# Altium schematic sheet Heirarchy.SchDoc
size D; DrawnBy: Ross Harvey; Engineer: Ross Harvey; Revision: A; SheetNumber: 1; SheetTotal: 7
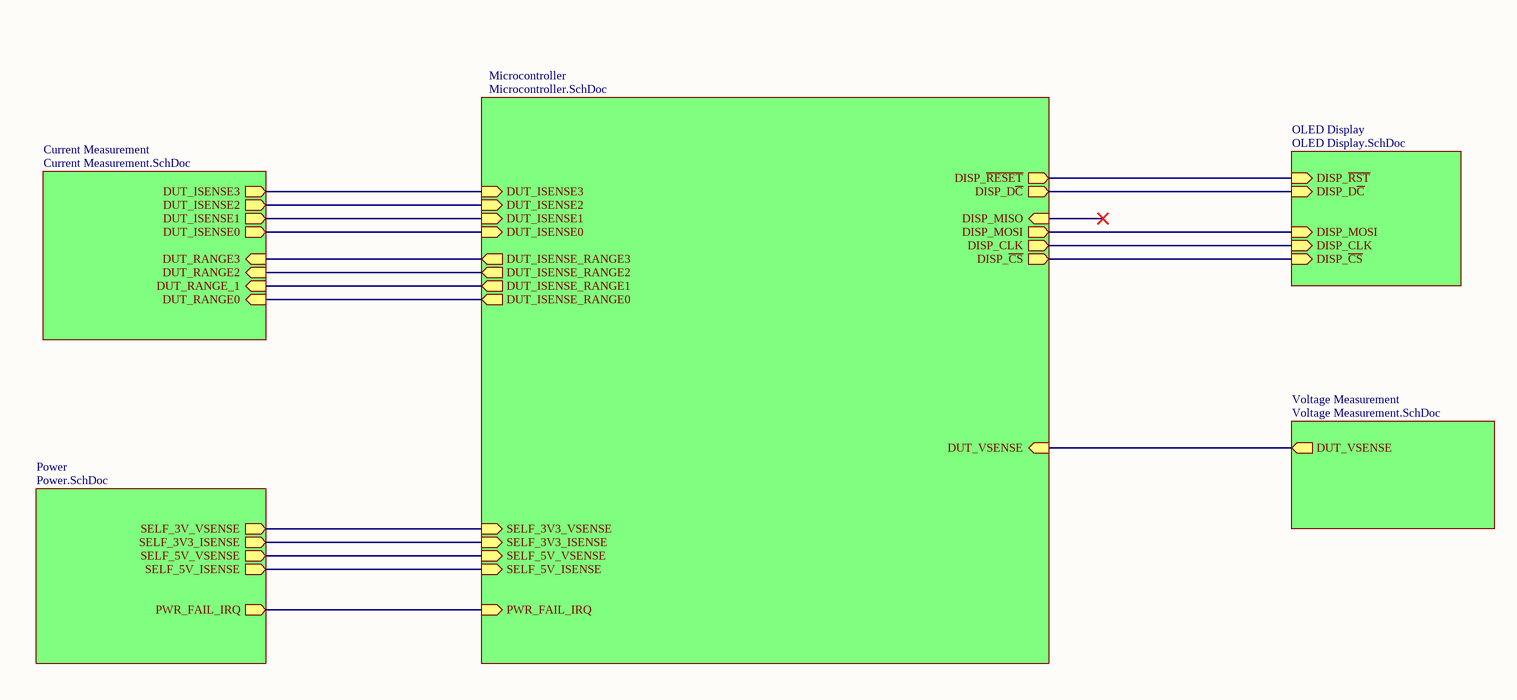
[diagram p0: Heirarchy.SchDoc, left]
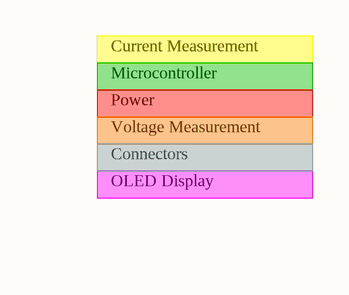
[diagram p1: Heirarchy.SchDoc, right]

## Sub-sheets
Current Measurement = Current Measurement.SchDoc: DUT_ISENSE2 (out), DUT_ISENSE1 (out), DUT_RANGE2 (in), DUT_RANGE0 (in), DUT_ISENSE3 (out), DUT_RANGE3 (in), DUT_RANGE_1 (in), DUT_ISENSE0 (out)
Microcontroller = Microcontroller.SchDoc: DISP_MISO (in), SELF_3V3_ISENSE (in), DISP_CLK (out), PWR_FAIL_IRQ (in), DISP_~{CS} (out), DUT_ISENSE_RANGE1 (out), SELF_5V_VSENSE (in), DUT_ISENSE_RANGE0 (out), DISP_MOSI (out), SELF_5V_ISENSE (in), DUT_VSENSE (in), DUT_ISENSE_RANGE2 (out), DISP_D~{C} (out), DUT_ISENSE_RANGE3 (out), DUT_ISENSE0 (in), DISP_~{RESET} (out), DUT_ISENSE2 (in), DUT_ISENSE3 (in), DUT_ISENSE1 (in), SELF_3V3_VSENSE (in)
OLED Display = OLED Display.SchDoc: DISP_~{CS} (in), DISP_CLK (in), DISP_MOSI (in), DISP_~{RST} (in), DISP_D~{C} (in)
Power = Power.SchDoc: SELF_5V_VSENSE (out), SELF_5V_ISENSE (out), SELF_3V3_ISENSE (out), PWR_FAIL_IRQ (out), SELF_3V_VSENSE (out)
Voltage Measurement = Voltage Measurement.SchDoc: DUT_VSENSE (out)

## Nets
(unnamed): sheet Current Measurement/DUT_ISENSE2, sheet Microcontroller/DUT_ISENSE2
(unnamed): sheet Current Measurement/DUT_ISENSE1, sheet Microcontroller/DUT_ISENSE1
(unnamed): sheet Current Measurement/DUT_RANGE2, sheet Microcontroller/DUT_ISENSE_RANGE2
(unnamed): sheet Current Measurement/DUT_RANGE0, sheet Microcontroller/DUT_ISENSE_RANGE0
(unnamed): sheet Current Measurement/DUT_ISENSE3, sheet Microcontroller/DUT_ISENSE3
(unnamed): sheet Current Measurement/DUT_RANGE3, sheet Microcontroller/DUT_ISENSE_RANGE3
(unnamed): sheet Current Measurement/DUT_RANGE_1, sheet Microcontroller/DUT_ISENSE_RANGE1
(unnamed): sheet Current Measurement/DUT_ISENSE0, sheet Microcontroller/DUT_ISENSE0
(unnamed): sheet Microcontroller/SELF_3V3_ISENSE, sheet Power/SELF_3V3_ISENSE
(unnamed): sheet Microcontroller/DISP_CLK, sheet OLED Display/DISP_CLK
(unnamed): sheet Microcontroller/PWR_FAIL_IRQ, sheet Power/PWR_FAIL_IRQ
(unnamed): sheet Microcontroller/DISP_~{CS}, sheet OLED Display/DISP_~{CS}
(unnamed): sheet Microcontroller/SELF_5V_VSENSE, sheet Power/SELF_5V_VSENSE
(unnamed): sheet Microcontroller/DISP_MOSI, sheet OLED Display/DISP_MOSI
(unnamed): sheet Microcontroller/SELF_5V_ISENSE, sheet Power/SELF_5V_ISENSE
(unnamed): sheet Microcontroller/DUT_VSENSE, sheet Voltage Measurement/DUT_VSENSE
(unnamed): sheet Microcontroller/DISP_D~{C}, sheet OLED Display/DISP_D~{C}
(unnamed): sheet Microcontroller/DISP_~{RESET}, sheet OLED Display/DISP_~{RST}
(unnamed): sheet Microcontroller/SELF_3V3_VSENSE, sheet Power/SELF_3V_VSENSE

## Notes on the sheet
- Current Measurement
- Microcontroller
- Power
- Voltage Measurement
- Connectors
- OLED Display